# Altium schematic sheet LCL_MCU.SchDoc
size A3; Organization: Altium Limited; Address1: L3, 12a Rodborough Rd; Address2: Frenchs Forest; Address3: NSW; Address4: Australia 2086
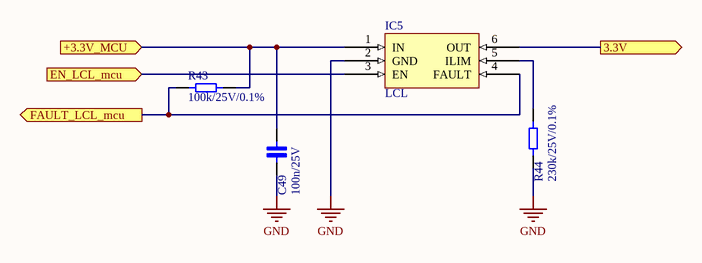
[diagram p0: LCL_MCU.SchDoc]

## Parts
C49  100n/25V  [CAP_0603]
IC5  LCL  [SOT-23-6]
R43  100k/25V/0.1%  [RES_0603]
R44  230k/25V/0.1%  [RES_0603]

## Ports
3.3V (out), +3.3V_MCU (in), EN_LCL_mcu (in), FAULT_LCL_mcu (out)

## Nets
GND: C49.2 IC5.2(GND) R44.2
3.3V: IC5.6(OUT) ; port 3.3V
+3.3V_MCU: C49.2 IC5.1(IN) R43.2 ; port +3.3V_MCU
EN_LCL_mcu: IC5.3(EN) ; port EN_LCL_mcu
FAULT_LCL_mcu: IC5.4(FAULT) R43.2 ; port FAULT_LCL_mcu
NetIC5_5: IC5.5(ILIM) R44.2

## Notes on the sheet
- Title
- Size:
- Date:
- A3
- Number:
- Time:
- Revision:
- Sheet
- of
- File:

## Library data of the parts
C49 = Cap_0603_100n: Ceramic Capacitor 100n / 0603 / 25V / ±5%, Wurth Elektronik MLCC; ComponentLink1Description: New link; ComponentLink1URL: https://www.we-online.com/catalog/en/WCAP-CSGP-25VDC
IC5 = TPS2553: Latch-off Current Limiter; ComponentLink1Description: New link; ComponentLink1URL: https://www.ti.com/lit/ds/symlink/tps2553.pdf?ts=1603819295065&ref_url=https%253A%252F%252Fwww.google.com%252F
R43 = Res_0603_100k: Vishay, thin film resistor 100k/25V/0.1%
R44 = Res_0603_230k: Vishay, thin film resistor 230k/25V/0.1%